# EasyEDA Pro project ProPrj_Practice 4 layer_2025-08-23.epro, schematic Schematic1
Board Name: Main; Create Date: 2025-08-18; Page Name: P1; Project Name: Practice 4 layer; Schematic Name: Schematic1; Update Date: 2025-08-18; Company: EasyEDA.com; Page Size: A4; Version: V1.0
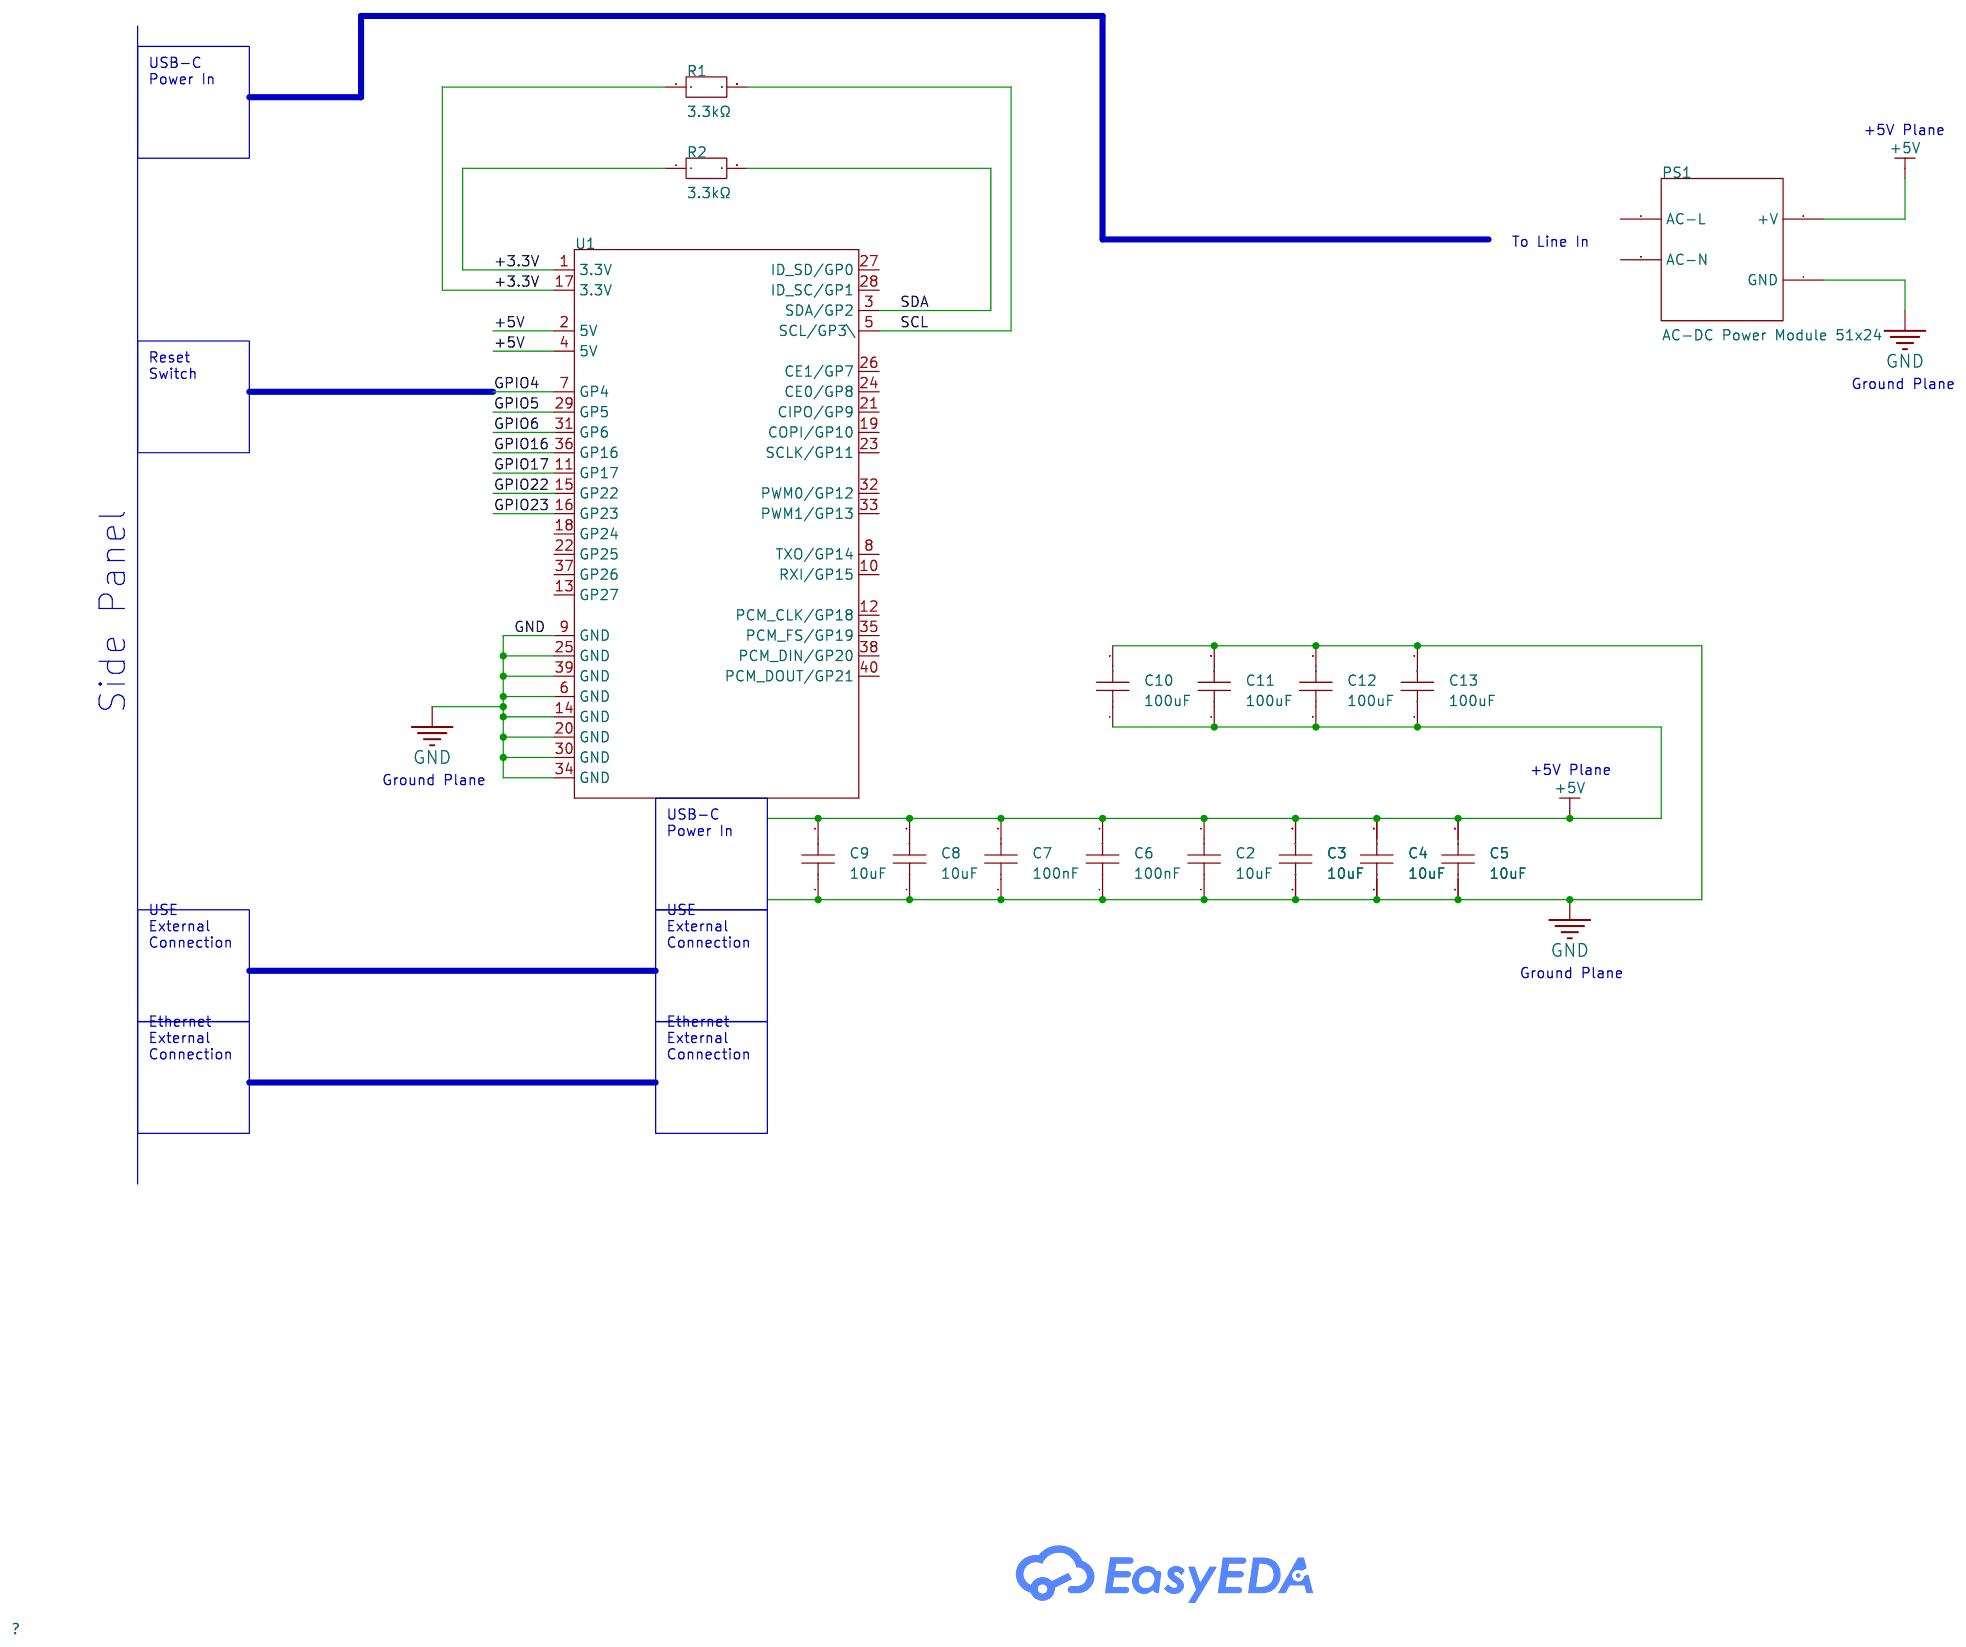
[diagram p3: schematic sheet]

## Parts
C2  10uF  [C0603]
C3  10uF  [C0603]
C4  10uF  [C0603]
C5  10uF  [C0603]
C6  100nF  [C0603]
C7  100nF  [C0603]
C8  10uF  [C0603]
C9  10uF  [C0603]
C10  100uF  [C0805]
C11  100uF  [C0805]
C12  100uF  [C0805]
C13  100uF  [C0805]
PS1  AC-DC Power Module 51x24  [ACDC_Module_51x24_TH]
R1  3.3kΩ  [R0603]
R2  3.3kΩ  [R0603]
U1  -  [RPI_HEADER_MINIMAL]

## Library data of the parts
C2-C5 C8 C9 = C0603B106M007T: Capacitance:10uF Tolerance:±20% Tolerance:±20% Voltage Rating:6.3V Temperature Coefficient:X5R; LCSC Part Name: 10uF ±20% 6.3V; Supplier Part: C7094065; Manufacturer: IHHEC(禾伸堂); Supplier Footprint: 0603; JLCPCB Part Class: Extended Part; Datasheet: https://item.szlcsc.com/datasheet/C0603B106M007T/8060709.html; Supplier: LCSC; Tolerance: ±20%; Voltage Rating: 6.3V; Temperature Coefficient: X5R
C6 C7 = 0603X7R104K500NT: Capacitance:100nF Tolerance:±10% Tolerance:±10% Voltage Rating:50V Temperature Coefficient:X7R; LCSC Part Name: 100nF ±10% 50V; Supplier Part: C48579281; Manufacturer: AIDE(爱迪电容); Supplier Footprint: 0603; JLCPCB Part Class: Extended Part; Datasheet: https://atta.szlcsc.com/upload/public/pdf/source/20210330/C2691711_5D01E1D4D7BF54205139C8425089DFE9.pdf; Supplier: LCSC; Tolerance: ±10%; Voltage Rating: 50V; Temperature Coefficient: X7R
C10-C13 = HGC0805R5107M6R3NSLJ: Capacitance:100uF Tolerance:±20% Tolerance:±20% Voltage Rating:6.3V Temperature Coefficient:X5R; LCSC Part Name: 100uF ±20% 6.3V; Supplier Part: C49333236; Manufacturer: Chinocera(华瓷); Supplier Footprint: 0805; JLCPCB Part Class: Extended Part; Datasheet: https://item.szlcsc.com/datasheet/HGC0805R5107M6R3NSLJ/51817927.html; Supplier: LCSC; Tolerance: ±20%; Voltage Rating: 6.3V; Temperature Coefficient: X5R
PS1 = 5VDC Through Hole Mount
R1 R2 = AC0603FR-7W3K3L: Type:Thick Film Resistor Resistance:3.3kΩ Tolerance:±1% Tolerance:±1% Power(Watts):200mW Voltage-Supply(Max):75V Temperature Coefficient:±100ppm/℃ Temperature Coefficient:±100ppm/℃ Operating Temperature:-55℃~+155℃ Operating Temperature:-55℃~+155℃; LCSC Part Name: 厚膜电阻 3.3kΩ ±1% 200mW; Supplier Part: C6457836; Manufacturer: YAGEO(国巨); Supplier Footprint: 0603; JLCPCB Part Class: Extended Part; Datasheet: https://item.szlcsc.com/datasheet/AC0603FR-7W3K3L/7411007.html; Supplier: LCSC; Type: Thick Film Resistor; Tolerance: ±1%; Power(Watts): 200mW; Voltage-Supply(Max): 75V; Temperature Coefficient: ±100ppm/℃; Operating Temperature: -55℃~+155℃
U1 = RASPBERRYPI-40-PIN-GPIO_PTH_REF

## Nets
+3.3V: R1.1 R2.1 U1.1(3.3V) U1.17(3.3V)
+5V: C2.2 C3.2 C4.2 C5.2 C6.2 C7.2 C8.2 C9.2 C10.1 C11.1 C12.1 C13.1 PS1.3(+V) U1.2(5V) U1.4(5V)
GND: C2.1 C3.1 C4.1 C5.1 C6.1 C7.1 C8.1 C9.1 C10.2 C11.2 C12.2 C13.2 PS1.4(GND) U1.6(GND) U1.9(GND) U1.14(GND) U1.20(GND) U1.25(GND) U1.30(GND) U1.34(GND) U1.39(GND)
GPIO4: U1.7(GP4)
GPIO5: U1.29(GP5)
GPIO6: U1.31(GP6)
GPIO16: U1.36(GP16)
GPIO17: U1.11(GP17)
GPIO22: U1.15(GP22)
GPIO23: U1.16(GP23)
SCL: R1.2 U1.5(SCL/GP3\)
SDA: R2.2 U1.3(SDA/GP2)

Not connected (* = marked no-connect by the designer): PS1 1(AC-L) 2(AC-N); U1 8(TXO/GP14) 10(RXI/GP15) 12(PCM_CLK/GP18) 13(GP27) 18(GP24) 19(COPI/GP10) 21(CIPO/GP9) 22(GP25) 23(SCLK/GP11) 24(CE0/GP8) 26(CE1/GP7) 27(ID_SD/GP0) 28(ID_SC/GP1) 32(PWM0/GP12) 33(PWM1/GP13) 35(PCM_FS/GP19) 37(GP26) 38(PCM_DIN/GP20) 40(PCM_DOUT/GP21)

## Notes on the sheet
- USB-C
  Power In
- +5V Plane
- To Line In
- Reset
  Switch
- Ground Plane
- Side Panel
- Ground Plane
- +5V Plane
- USB-C
  Power In
- USE
  External
  Connection
- USE
  External
  Connection
- Ground Plane
- Ethernet
  External
  Connection
- Ethernet
  External
  Connection
